# EAGLE design Arbol-Iot_V1-0 (EAGLE 9.3.0)
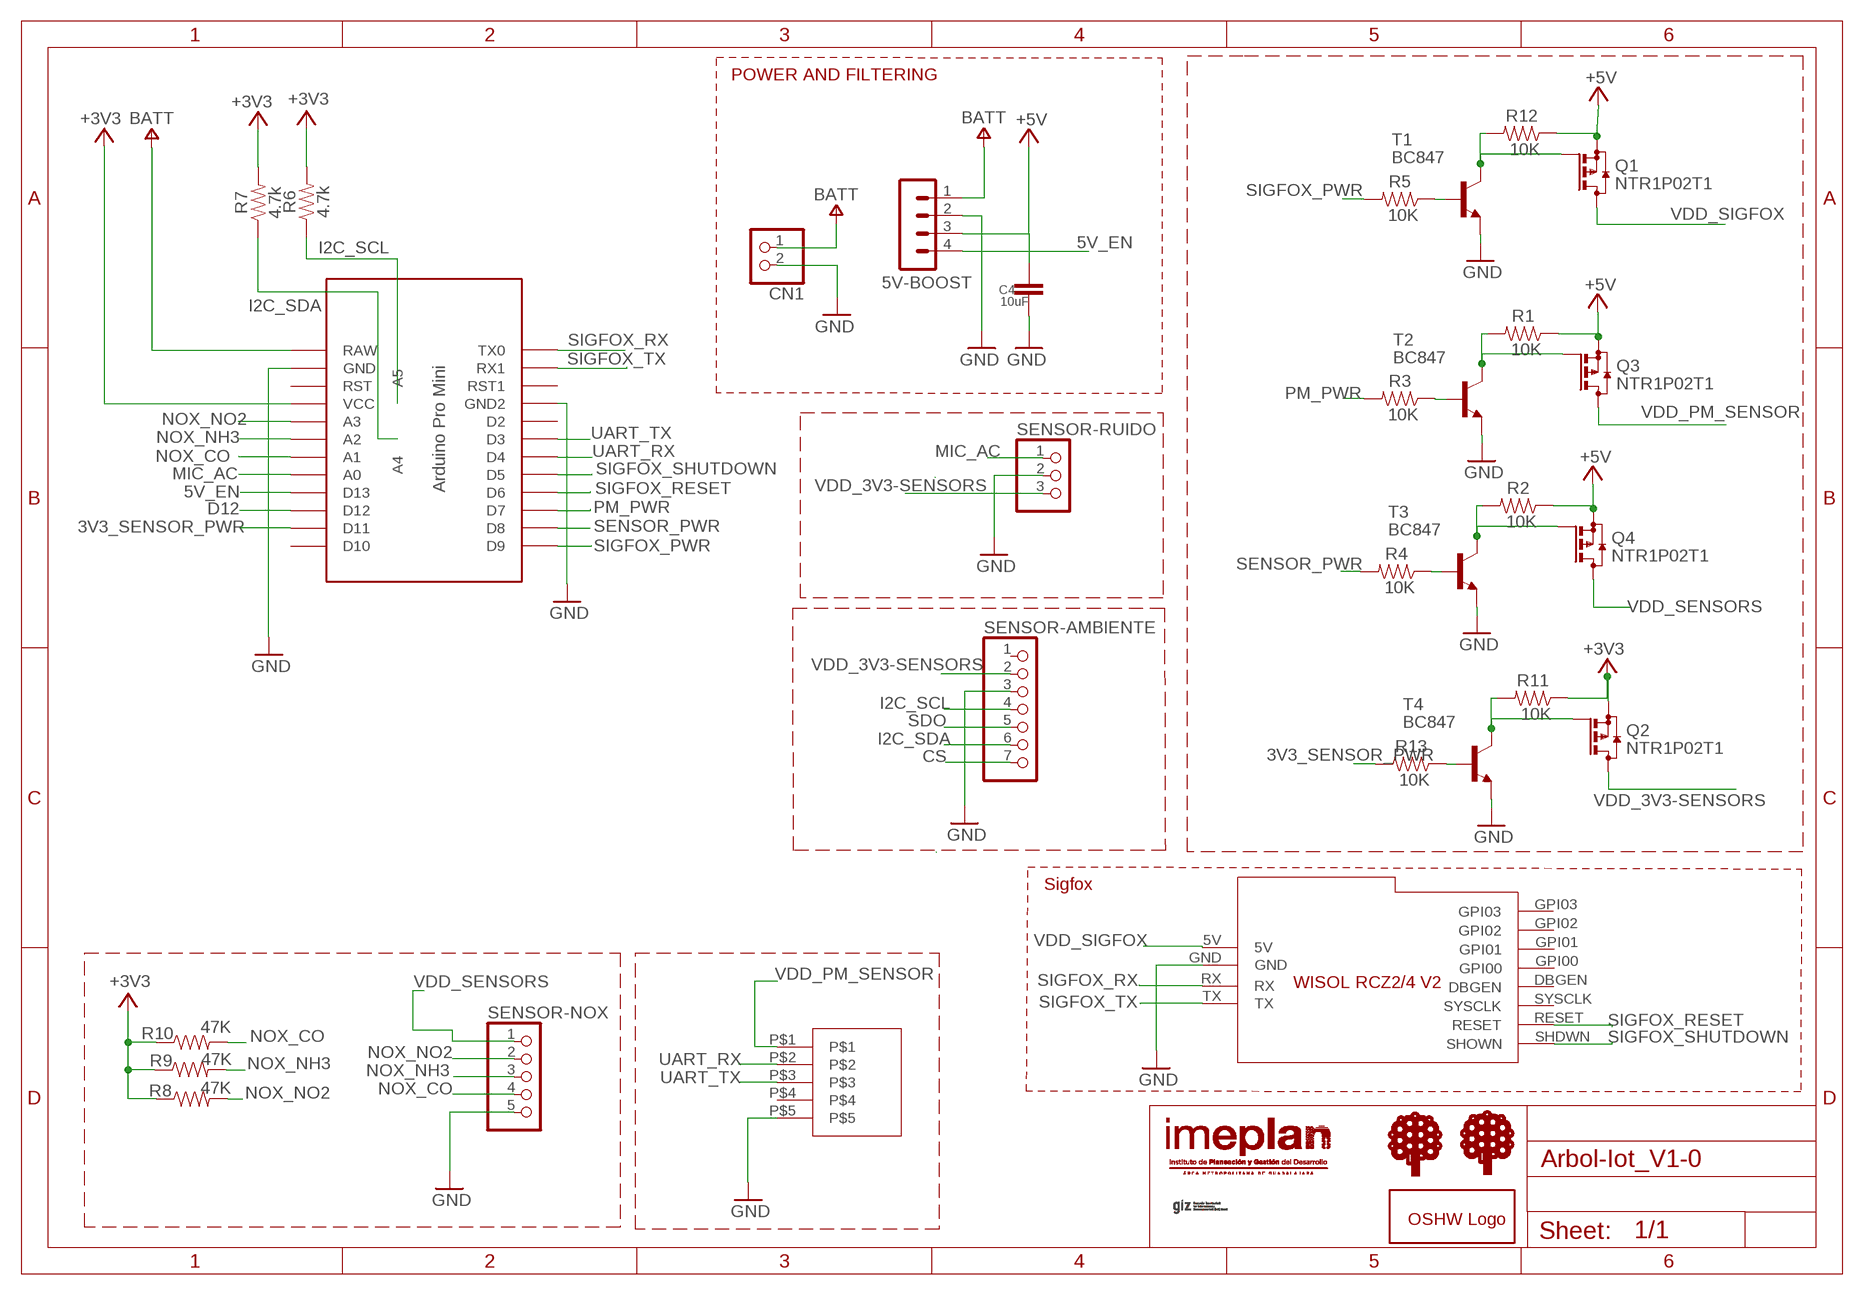
[diagram p0: schematic, sheet 1]

## Parts
5V-BOOST  MA04-1  [MA04-1]
C4  10uF  C-EUC1206  [C1206]
CN1  JST_2PIN-SMT-RA  [JST-PH-2-SMT-RA]
GOLD_ORB_SM1  OSHWLOGOLOGO5MM  [OSHW_5MM]
PM-SENSOR  S5B-ZR-3.4  [S5B-ZR-3.4]
Q1  NTR1P02T1  BSS84  [SOT23]
Q2  NTR1P02T1  BSS84  [SOT23]
Q3  NTR1P02T1  BSS84  [SOT23]
Q4  NTR1P02T1  BSS84  [SOT23]
R1  10K  10OHM-1206-1/4W-1%  [1206]
R2  10K  10OHM-1206-1/4W-1%  [1206]
R3  10K  10OHM-1206-1/4W-1%  [1206]
R4  10K  10OHM-1206-1/4W-1%  [1206]
R5  10K  10OHM-1206-1/4W-1%  [1206]
R6  4.7k  10OHM-1206-1/4W-1%  [1206]
R7  4.7k  10OHM-1206-1/4W-1%  [1206]
R8  47K  10OHM-1206-1/4W-1%  [1206]
R9  47K  10OHM-1206-1/4W-1%  [1206]
R10  47K  10OHM-1206-1/4W-1%  [1206]
R11  10K  10OHM-1206-1/4W-1%  [1206]
R12  10K  10OHM-1206-1/4W-1%  [1206]
R13  10K  10OHM-1206-1/4W-1%  [1206]
SENSOR-AMBIENTE  PINHD-1X7  [1X07]
SENSOR-NOX  PINHD-1X5  [1X05]
SENSOR-RUIDO  PINHD-1X3  [1X03]
T1  BC847  [SOT23]
T2  BC847  [SOT23]
T3  BC847  [SOT23]
T4  BC847  [SOT23]
U$1  GIZ-LOGO  [GIZ-LOGO]
U$2  WISOL-RCZ2/4V2  [BREAKOUT-WISOL-SIGFOX]
U$3  ARBOL-IOT-LETRAS  [ARBOL-IOT-LETRAS]
U$4  BAST  [BAST]
U$6  ARBOL-IOT-LETRAS  [ARBOL-IOT-LETRAS]
U$7  IMEPLAN-LOGO  [IMEPLAN-LOGO]

## Nets
3V3_SENSOR_PWR: R13.2 U$4.D11
5V_EN: 5V-BOOST.4 U$4.D13
+3V3: Q2.2(S) R6.2 R7.2 R8.1 R9.1 R10.1 R11.1 U$4.VCC
+5V: 5V-BOOST.3 C4.1 Q1.2(S) Q3.2(S) Q4.2(S) R1.1 R2.1 R12.1
CS: SENSOR-AMBIENTE.7
D12: U$4.D12
GND: 5V-BOOST.2 C4.2 CN1.2 PM-SENSOR.P$5 SENSOR-AMBIENTE.3 SENSOR-NOX.5 SENSOR-RUIDO.2 T1.2(E) T2.2(E) T3.2(E) T4.2(E) U$2.GND U$4.GND U$4.GND1(GND2)
I2C_SCL: R6.1 SENSOR-AMBIENTE.4 U$4.A5
I2C_SDA: R7.1 SENSOR-AMBIENTE.6 U$4.A4
MIC_AC: SENSOR-RUIDO.1 U$4.A0
N$1: R5.1 T1.1(B)
N$2: R3.1 T2.1(B)
N$3: R4.1 T3.1(B)
N$4: Q2.1(G) R11.2 T4.3(C)
N$5: Q1.1(G) R12.2 T1.3(C)
N$6: Q3.1(G) R1.2 T2.3(C)
N$7: Q4.1(G) R2.2 T3.3(C)
N$8: R13.1 T4.1(B)
NOX_CO: R10.2 SENSOR-NOX.4 U$4.A1
NOX_NH3: R9.2 SENSOR-NOX.3 U$4.A2
NOX_NO2: R8.2 SENSOR-NOX.2 U$4.A3
PM_PWR: R3.2 U$4.D7
SDO: SENSOR-AMBIENTE.5
SENSOR_PWR: R4.2 U$4.D8
SIGFOX_PWR: R5.2 U$4.D9
SIGFOX_RESET: U$2.RESET U$4.D6
SIGFOX_RX: U$2.RX U$4.TX0
SIGFOX_SHUTDOWN: U$2.SHDWN(SHOWN) U$4.D5
SIGFOX_TX: U$2.TX U$4.RX1
UART_RX: PM-SENSOR.P$2 U$4.D4
UART_TX: PM-SENSOR.P$3 U$4.D3
V+: 5V-BOOST.1 CN1.1 U$4.RAW ; supply symbol labelled BATT
VDD_3V3-SENSORS: Q2.3(D) SENSOR-AMBIENTE.2 SENSOR-RUIDO.3
VDD_PM_SENSOR: PM-SENSOR.P$1 Q3.3(D)
VDD_SENSORS: Q4.3(D) SENSOR-NOX.1
VDD_SIGFOX: Q1.3(D) U$2.5V
Unconnected: PM-SENSOR.P$4 SENSOR-AMBIENTE.1 U$2.DBGEN U$2.GPI00 U$2.GPI01 U$2.GPI02 U$2.GPI03 U$2.SYSCLK U$4.D2 U$4.D10 U$4.RST U$4.RST1

## Notes on the sheet
- POWER AND FILTERING
- Sigfox

## Library data of the parts
5V-BOOST = con-lstb:MA04-1: PIN HEADER; OC_FARNELL: unknown; OC_NEWARK: unknown
C4 = resistor:C-EU: CAPACITOR, European symbol; OC_NEWARK: unknown
CN1 = adafruit:JST_2PIN: JST 2-Pin Connectors of various flavors SMT-RA (S2B-PH-SM4) 4UConnector #17311 SMT (B2B-PH-SM4) THM-RA (S2B-PH) THM (B2B-PH)
GOLD_ORB_SM1 = oshw:OSHWLOGO: The OSHW logo for PCB layout
PM-SENSOR = StarlightMX:S5B-ZR-3.4
Q1-Q4 = transistor-small-signal:BSS84: P-CHANNEL MOS FET
R1-R13 = SparkFun-Resistors:10OHM: 10Ω resistor A resistor is a passive two-terminal electrical component that implements electrical resistance as a circuit element. Resistors act to reduce current flow, and, at the same time, act to lower voltage levels within circuits. - Wikipedia; PROD_ID: RES-08705; VALUE: 10
SENSOR-AMBIENTE = pinhead:PINHD-1X7: PIN HEADER
SENSOR-NOX = pinhead:PINHD-1X5: PIN HEADER
SENSOR-RUIDO = pinhead:PINHD-1X3: PIN HEADER
T1-T4 = transistor:BC847: NPN TRANSISTOR
U$1 = StarlightMX:GIZ-LOGO
U$2 = StarlightMX:WISOL-RCZ2/4V2
U$3 U$6 = StarlightMX:ARBOL-IOT-LETRAS
U$4 = Arduino-clone:BAST
U$7 = StarlightMX:IMEPLAN-LOGO

## Board
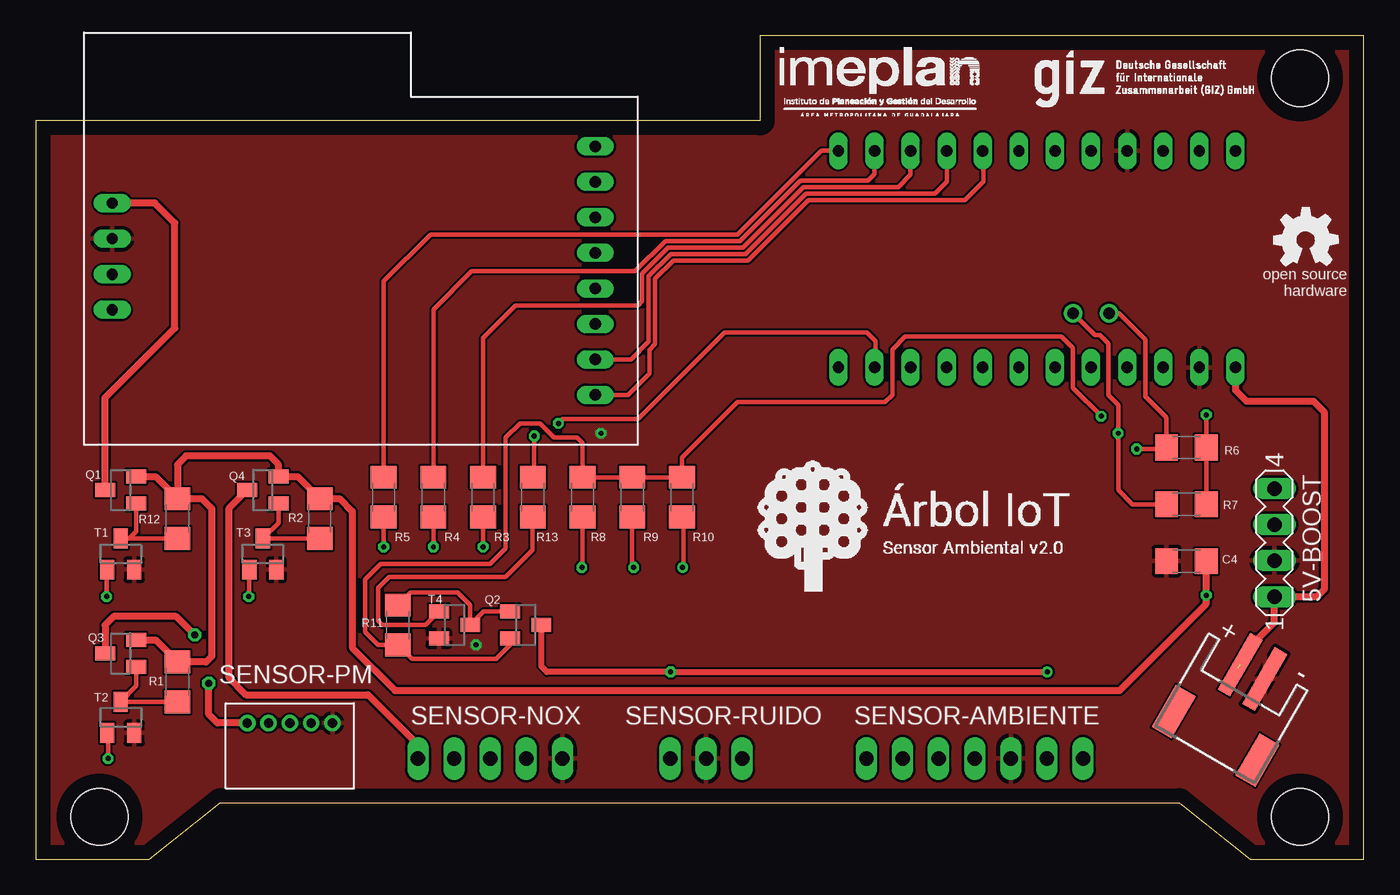
[diagram p1: board, top side]
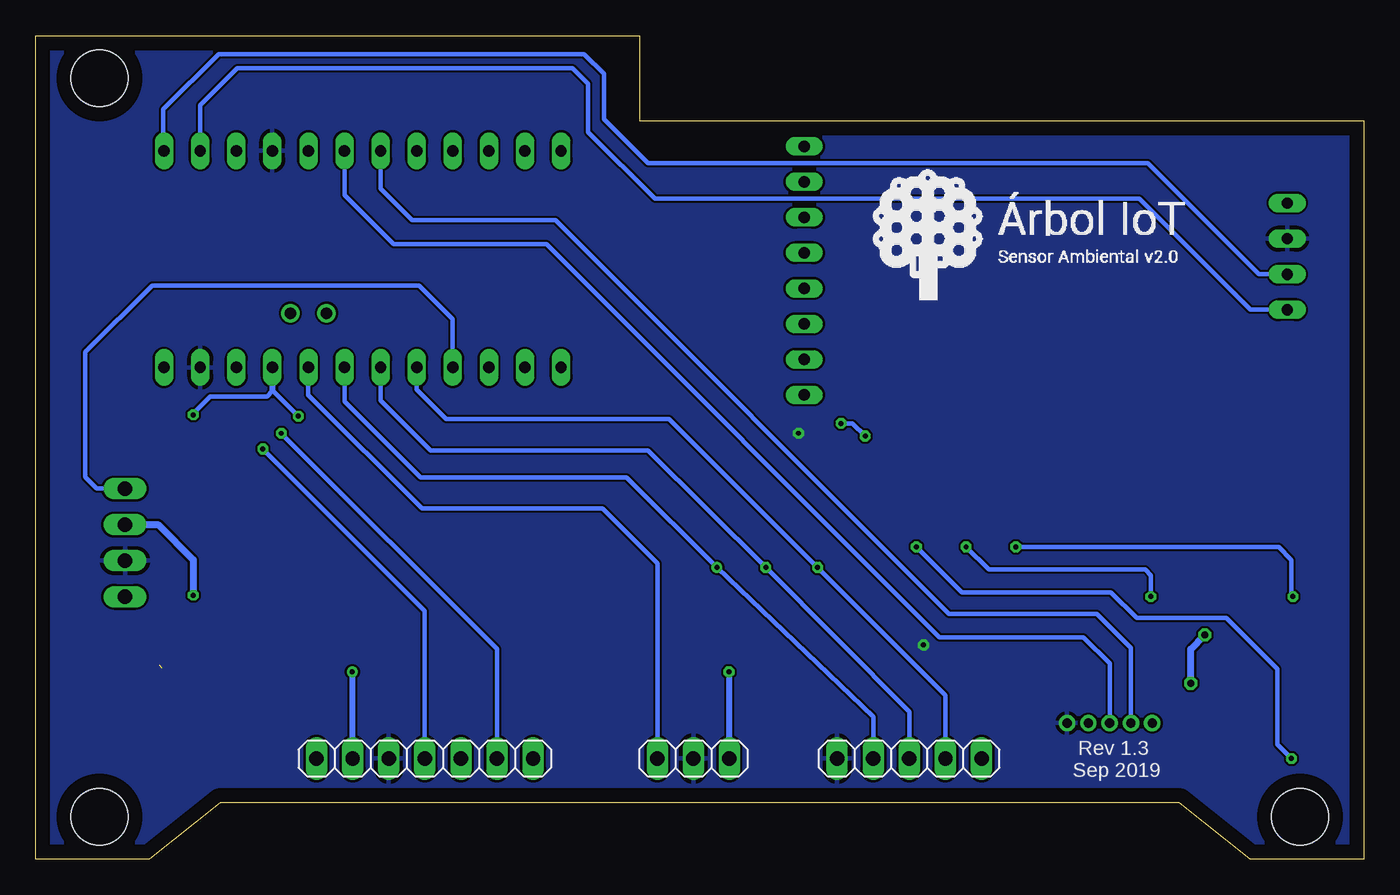
[diagram p2: board, bottom side, seen from below]

Size 93.5 x 58 mm. Coordinates in mm from the lower left corner, seen from the top.
Outline: 93.5,0 93.5,58 51,58 51,52 0,52 0,0 8,0 13,4 80.5,4 85.5,0 93.5,0
Copper layers (1*16): Top 0.035mm / dielectric 1.5mm / Bottom 0.035mm
Design rules "default": minimum track width 6mil, minimum drill 0.35mm, track to track 6mil, track to pad 6mil, pad to pad 6mil, via to via 6mil, smd to smd 6mil, copper to edge 40mil, drill to drill 6mil, minimum pad ring 10mil, minimum via ring 8mil, stop-mask expansion 4mil, vias tented up to drill 0mil, thermal gap 10mil
Holes 4 mm at 89,55 89,3 4.5,3

### Footprints (pad centres in the part's own frame; a part is rotated, then mirrored left to right if it is on the bottom)
MA04-1 = drill 1.016 long: 1 -3.81,0; 2 -1.27,0; 3 1.27,0; 4 3.81,0
C1206 = smd 1.6 x 1.8: 1 -1.4,0; 2 1.4,0
JST-PH-2-SMT-RA = smd 1 x 4.6: 1 1,-3.7; 2 -1,-3.7 | smd 1.6 x 3.4: NC1 -3.4,1.5; NC2 3.4,1.5
S5B-ZR-3.4 = drill 0.65: P$1 -3,2; P$2 -1.5,2; P$3 0,2; P$4 1.5,2; P$5 3,2
SOT23 = smd 1 x 1.4: 1 -0.95,-1.1; 2 0.95,-1.1; 3 0,1.1
1206 = smd 1.6 x 1.8: 1 -1.4,0; 2 1.4,0
1X07 = drill 1.016 long: 1 -7.62,0; 2 -5.08,0; 3 -2.54,0; 4 0,0; 5 2.54,0; 6 5.08,0; 7 7.62,0
1X05 = drill 1.016 long: 1 -5.08,0; 2 -2.54,0; 3 0,0; 4 2.54,0; 5 5.08,0
1X03 = drill 1.016 long: 1 -2.54,0; 2 0,0; 3 2.54,0
BREAKOUT-WISOL-SIGFOX = drill 0.8 long: 5V 2,17; DBGEN 36,11; GND 2,14.5; GPI00 36,13.5; GPI01 36,16; GPI02 36,18.5; GPI03 36,21; RESET 36,6; RX 2,12; SHDWN 36,3.5; SYSCLK 36,8.5; TX 2,9.5
BAST = drill 0.8 long: A0 10.16,-3.81; A1 10.16,-6.35; A2 10.16,-8.89; A3 10.16,-11.43; D2 -5.08,-3.81; D3 -5.08,-6.35; D4 -5.08,-8.89; D5 -5.08,-11.43; D6 -5.08,-13.97; D7 -5.08,-16.51; D8 -5.08,-19.05; D9 -5.08,-21.59; D10 10.16,-21.59; D11 10.16,-19.05; D12 10.16,-16.51; D13 10.16,-13.97; GND 10.16,3.81; GND1 -5.08,-1.27; RAW 10.16,6.35; RST 10.16,1.27; RST1 -5.08,1.27; RX1 -5.08,3.81; TX0 -5.08,6.35; VCC 10.16,-1.27 | drill 0.8: A4 6.35,-5.08; A5 6.35,-2.54

### Placement (x,y rotation side)
5V-BOOST  87.2,22.3 90 top
C4  81,21 180 top
CN1  83.8,10 150 top
GOLD_ORB_SM1  89.4,43.6 0 top
PM-SENSOR  17.9,7.6 0 top
Q1  6,26 90 top
Q2  34.5,16.5 270 top
Q3  6,14.5 90 top
Q4  16,26 90 top
R1  10,12.5 270 top
R2  20,24 270 top
R3  31.5,25.5 90 top
R4  28,25.5 90 top
R5  24.5,25.5 90 top
R6  81,29 0 top
R7  81,25 0 top
R8  38.5,25.5 270 top
R9  42,25.5 270 top
R10  45.5,25.5 270 top
R11  25.5,16.5 90 top
R12  10,24 270 top
R13  35,25.5 90 top
SENSOR-AMBIENTE  66.1,7.1 0 bottom
SENSOR-NOX  32,7.1 180 bottom
SENSOR-RUIDO  47.2,7.1 0 bottom
T1  6,21.5 0 top
T2  6,10 0 top
T3  16,21.5 0 top
T4  29.5,16.5 270 top
U$1  77.1,54.8 0 top
U$2  3.4,29.2 0 top
U$3  35.1,38.8 0 bottom
U$4  78.1,44.8 270 top
U$6  50.3,18.3 0 top
U$7  58.9,55.5 0 top

### Tracks (layer width: path | path; a pad name or v marks a point on that pad's centre or on a via)
3V3_SENSOR_PWR  (via drill 0.35)
  Top 0.305: U$4.D11 59.1,34.69 59.1,36.5 58.5,37.1 48.5,37.1 42.4,31 37.1,31 v36.8,30.7 | v35.1,29.8 35.1,27 R13.2
  Bottom 0.305: v36.8,30.7 36,30.7 v35.1,29.8
5V_EN
  Bottom 0.305: U$4.D13 64.13,38.03 66.5,40.4 85.3,40.4 90,35.7 90,26.91 89.2,26.11 5V-BOOST.4
+3V3  (via drill 0.35)
  Top 0.305: R7.2 R6.2 v82.4,31.3 | Q2.2 33.4,15.1 32.4,14.1 26.5,14.1 R11.1 24.1,15.1 23.2,16 23.2,19.7 24.3,20.8 32,20.8 33.1,21.9 33.1,29.7 34.1,30.7 35.5,30.7 36.5,29.7 38.1,29.7 38.5,29.3 R8.1 R9.1 R10.1 45.5,28.3 49.4,32.2 59.8,32.2 60.3,32.7 60.3,35.9 61.2,36.8 72.2,36.8 73,36 73,33.2 v75,31.2
  Bottom 0.305: v82.4,31.3 82.4,31.4 81.2,32.6 77.2,32.6 76.83,32.97 U$4.VCC | 76.83,33.03 v75,31.2
  Bottom 0.406: U$4.VCC 76.83,33.03
+5V  (via drill 0.35)
  Top 0.508: Q1.2 8.45,26.95 R12.1 | Q3.2 8.45,15.45 R1.1 12,13.9 12.4,14.3 12.4,24.7 11.7,25.4 R12.1 | R12.1 10,27.8 10.6,28.4 16.5,28.4 17.1,27.8 Q4.2 18.45,26.95 R2.1 21.4,25.4 22.3,24.5 22.3,14.9 25.3,11.9 76.3,11.9 82.4,18 v82.4,18.6 C4.1
  Bottom 0.508: 5V-BOOST.3 84.87,23.57 82.4,21.1 v82.4,18.6
GND  (via drill 0.35)
  other vias: 31,15.1 39.8,30
  pour Top: -0.5,-1.2 -0.5,59.3 97.1,59.3 97.1,-1.2
  pour Bottom: -0.3,-1.6 -0.3,59.7 96.2,59.7 96.2,-1.6
I2C_SCL  (via drill 0.35)
  Top 0.305: U$4.A5 76.25,38.45 78.1,36.6 78.1,32.6 79.6,31.1 R6.1 79.5,28.9 v77.5,28.9
  Bottom 0.305: SENSOR-AMBIENTE.4 66.1,17.5 v77.5,28.9
I2C_SDA  (via drill 0.35)
  Top 0.305: U$4.A4 74.57,36.9 74.9,36.9 75.5,36.3 75.5,32.7 76.2,32 v76.2,30 76.2,26 77.2,25 R7.1
  Bottom 0.305: SENSOR-AMBIENTE.6 61.02,14.82 v76.2,30
MIC_AC
  Bottom 0.305: U$4.A0 74.3,32.7 66.3,24.7 53.6,24.7 49.74,20.84 SENSOR-RUIDO.1
N$1  (via drill 0.35)
  Top 0.305: R5.1 v24.5,22 | v5,18.5 5,20.35 T1.1
  Bottom 0.305: v24.5,22 6,22 5.1,21.1 5.1,18.6 v5,18.5
N$2  (via drill 0.35)
  Top 0.305: R3.1 v31.5,22 | v5.1,7.1 5.1,8.85 T2.1
  Bottom 0.305: v31.5,22 28.3,18.8 17.8,18.8 16,17 9.7,17 6.1,13.4 6.1,8.1 v5.1,7.1
N$3  (via drill 0.35)
  Top 0.305: 28.1,24 R4.1 v28,22 | 15,20.35 T3.1 15.05,18.55 v15,18.5
  Bottom 0.305: v28,22 26.4,20.4 15.4,20.4 15,20 v15,18.5
N$4
  Top 0.305: Q2.1 31.55,17.45 T4.3 30.6,17.9 29.7,18.8 26.4,18.8 R11.2
N$5
  Top 0.305: Q1.1 7.1,23.1 6.6,22.6 T1.3 R12.2
N$6
  Top 0.305: R1.2 T2.3 7.1,12.2 Q3.1
N$7
  Top 0.305: R2.2 18.3,22.6 T3.3 17.1,23.7 Q4.1
N$8
  Top 0.305: T4.1 27.45,16.5 24.4,16.5 24.1,16.8 24.1,19.1 24.9,19.9 33.1,19.9 35,21.8 R13.1
NOX_CO  (via drill 0.35)
  Top 0.305: R10.2 45.6,24 45.6,20.6 v45.55,20.55
  Bottom 0.305: U$4.A1 71.75,32.25 66.4,26.9 51.89,26.9 51.89,26.89 v45.55,20.55 | SENSOR-NOX.4 34.54,10.04 v45.55,20.55 | 45.65,20.55 v45.55,20.55
NOX_NH3  (via drill 0.35)
  Top 0.305: R9.2 42,20.6 v42.1,20.55
  Bottom 0.305: U$4.A2 69.21,32.31 65.7,28.8 50.4,28.8 v42.1,20.55 32,10.4 SENSOR-NOX.3
NOX_NO2  (via drill 0.35)
  Top 0.305: R8.2 38.5,20.6 v38.45,20.55
  Bottom 0.305: U$4.A3 66.67,33.07 64.6,31 48.9,31 42.05,24.15 v38.45,20.55 29.46,11.56 SENSOR-NOX.2
PM_PWR
  Top 0.305: R3.2 31.5,36.7 33.8,39 42.4,39 42.7,39.3 42.7,41.25 44.53,43.09 49.78,43.09 54.04,47.34 60.74,47.34 61.59,48.19 U$4.D7
SENSOR_PWR
  Top 0.305: R4.2 28,38.7 30.7,41.4 42.2,41.4 44.34,43.54 49.59,43.54 53.85,47.8 58.6,47.8 59.05,48.25 U$4.D8
SIGFOX_PWR
  Top 0.305: R5.2 24.5,40.7 27.8,44 49.4,44 55.3,49.9 56.49,49.9 U$4.D9
SIGFOX_RESET
  Top 0.305: U$2.RESET 41.9,35.2 43.16,36.46 43.16,41.06 44.72,42.63 49.97,42.63 54.23,46.89 63.29,46.89 64.13,47.73 U$4.D6
SIGFOX_RX
  Bottom 0.305: U$2.RX 7.4,41.2 15.2,49 50.4,49 53.5,52.1 53.5,55.3 54.9,56.7 80.6,56.7 84.5,52.8 84.5,49.93 U$4.TX0
SIGFOX_SHUTDOWN
  Top 0.305: U$2.SHDWN 41.7,32.7 43.2,34.2 43.2,35.85 43.61,36.27 43.61,40.88 44.91,42.17 50.16,42.17 54.41,46.43 65.43,46.43 66.7,47.7 66.7,49.85 U$4.D5
SIGFOX_TX
  Bottom 0.305: U$2.TX 8,38.7 15.8,46.5 49.9,46.5 54.6,51.2 54.6,54.6 55.7,55.7 79.3,55.7 81.91,53.09 U$4.RX1
UART_RX
  Bottom 0.305: PM-SENSOR.P$2 16.4,14.9 18.8,17.3 29.2,17.3 56.9,45 67,45 69.21,47.21 U$4.D4
UART_TX
  Bottom 0.305: PM-SENSOR.P$3 17.9,13.8 19.74,15.64 29.89,15.64 57.55,43.3 68.3,43.3 71.75,46.75 U$4.D3
V+  (1 unrouted)
  Top 0.508: 84.4,13.19 84.61,13.47 | CN1.1 84.88,13.8 84.88,14.38 87.2,16.7 5V-BOOST.1 90.19,18.49 90.7,19 90.7,31.5 89.96,32.24 85.25,32.24 84.45,33.04 U$4.RAW
VDD_3V3-SENSORS  (via drill 0.35)
  Top 0.406: Q2.3 35.6,13.6 36,13.2 v44.7,13.2 v71.2,13.2
  Bottom 0.406: v44.7,13.2 44.7,7.14 SENSOR-RUIDO.3 | v71.2,13.2 71.2,7.12 SENSOR-AMBIENTE.2
VDD_PM_SENSOR  (via drill 0.5)
  Top 0.508: PM-SENSOR.P$1 12.8,9.6 12.2,10.2 v12.2,12.4 | v11.2,15.8 9.9,17.1 5.5,17.1 4.9,16.5 Q3.3
  Bottom 0.508: v12.2,12.4 12.2,14.8 v11.2,15.8
VDD_SENSORS
  Top 0.508: Q4.3 13.6,24.7 13.6,12.8 14.8,11.6 23.4,11.6 26.92,8.08 SENSOR-NOX.1
VDD_SIGFOX
  Top 0.508: Q1.3 4.9,32.5 9.8,37.4 9.8,44.8 8.4,46.2 U$2.5V

### Text on the board
tPlace: SENSOR-PM
bPlace: Rev 1.3 / Sep 2019